# EAGLE schematic dexterity (EAGLE 8.6.0)
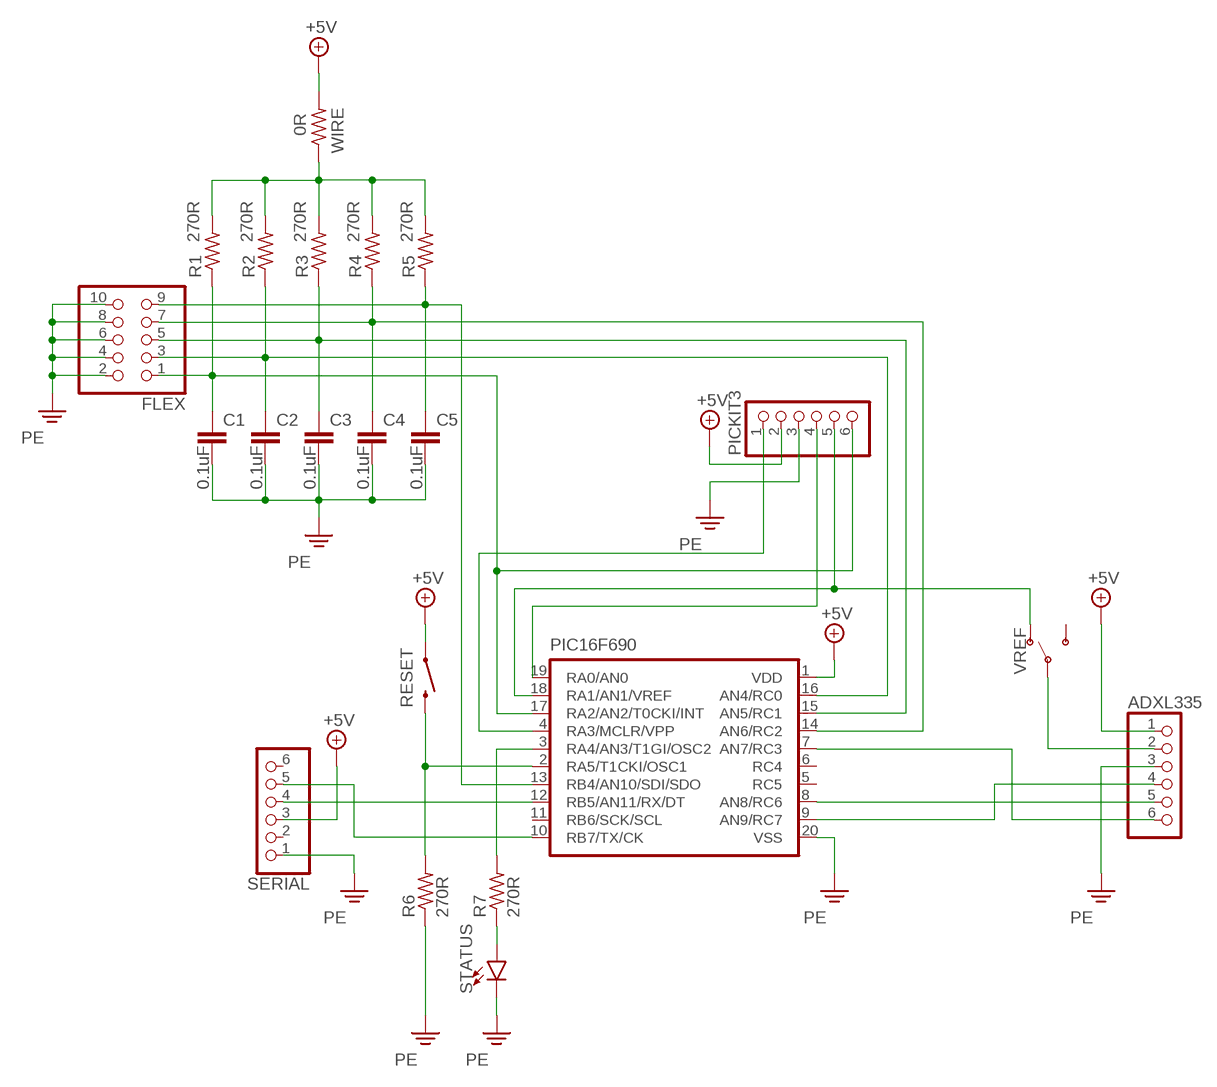
[diagram p0: schematic, sheet 1]

## Parts
ADXL335  PINHD-1X6/90  [1X06/90]
C1  0.1uF  C-EU050-025X075  [C050-025X075]
C2  0.1uF  C-EU050-025X075  [C050-025X075]
C3  0.1uF  C-EU050-025X075  [C050-025X075]
C4  0.1uF  C-EU050-025X075  [C050-025X075]
C5  0.1uF  C-EU050-025X075  [C050-025X075]
FLEX  PINHD-2X5/90  [2X05/90]
PIC16F690  PIC16F6XX  [DIL20]
PICKIT3  PINHD-1X6  [1X06]
R1  270R  R-US_0207/7  [0207/7]
R2  270R  R-US_0207/7  [0207/7]
R3  270R  R-US_0207/7  [0207/7]
R4  270R  R-US_0207/7  [0207/7]
R5  270R  R-US_0207/7  [0207/7]
R6  270R  R-US_0207/7  [0207/7]
R7  270R  R-US_0207/7  [0207/7]
RESET  MOMENTARY-SWITCH-SPST-PTH-6.0MM  [TACTILE_SWITCH_PTH_6.0MM]
SERIAL  PINHD-1X6/90  [1X06/90]
STATUS  LED3MM  [LED_3MM]
VREF  SWITCH-SPDT-PTH-11.6X4.0MM  [SWITCH_SPDT_PTH_11.6X4.0MM]
WIRE  0R  R-US_0207/7  [0207/7]

## Nets
+5V: ADXL335.1 PIC16F690.1(VDD) PICKIT3.2 R1.2 R2.2 R3.2 R4.2 R5.2 RESET.1 SERIAL.3 WIRE.1 WIRE.2
GND: ADXL335.3 C1.2 C2.2 C3.2 C4.2 C5.2 FLEX.2 FLEX.4 FLEX.6 FLEX.8 FLEX.10 PIC16F690.20(VSS) PICKIT3.3 R6.1 SERIAL.1 STATUS.K(C) ; supply symbol labelled PE
N$1: ADXL335.2 VREF.2(P)
N$2: PIC16F690.18(RA1/AN1/VREF) PICKIT3.5 VREF.1(O)
N$3: PIC16F690.12(RB5/AN11/RX/DT) SERIAL.4
N$4: PIC16F690.10(RB7/TX/CK) SERIAL.5
N$5: PIC16F690.3(RA4/AN3/T1GI/OSC2) R7.2
N$6: ADXL335.5 PIC16F690.8(AN8/RC6)
N$7: ADXL335.6 PIC16F690.7(AN7/RC3)
N$8: PIC16F690.4(RA3/MCLR/VPP) PICKIT3.1
N$9: C2.1 FLEX.3 PIC16F690.16(AN4/RC0) R2.1
N$10: PIC16F690.19(RA0/AN0) PICKIT3.4
N$11: C1.1 FLEX.1 PIC16F690.17(RA2/AN2/T0CKI/INT) PICKIT3.6 R1.1
N$12: C3.1 FLEX.5 PIC16F690.15(AN5/RC1) R3.1
N$13: C4.1 FLEX.7 PIC16F690.14(AN6/RC2) R4.1
N$14: C5.1 FLEX.9 PIC16F690.13(RB4/AN10/SDI/SDO) R5.1
N$16: ADXL335.4 PIC16F690.9(AN9/RC7)
N$17: R7.1 STATUS.A
N$18: PIC16F690.2(RA5/T1CKI/OSC1) R6.2 RESET.3
Unconnected: PIC16F690.5(RC5) PIC16F690.6(RC4) PIC16F690.11(RB6/SCK/SCL) SERIAL.2 SERIAL.6 VREF.3(S)

## Library data of the parts
ADXL335 PICKIT3 SERIAL = pinhead:PINHD-1X6: PIN HEADER
C1-C5 = rcl:C-EU: CAPACITOR, European symbol; SPICEPREFIX: C
FLEX = pinhead:PINHD-2X5: PIN HEADER
PIC16F690 = pic16f690:PIC16F6XX
R1-R7 WIRE = rcl:R-US_: RESISTOR, American symbol; SPICEPREFIX: R
RESET = SparkFun-Switches:MOMENTARY-SWITCH-SPST: Momentary Switch (Pushbutton) - SPST Normally-open (NO) SPST momentary switches (buttons, pushbuttons). Variants PTH-12MM - 12mm square, through-hole Momentary Pushbutton Switch - 12mm Square <https://www.sparkfun.com/products/9190> (COM-09190) PTH-6.0MM, PTH-6.0MM-KIT - 6.0mm square, through-hole Mini Pushbutton Switch <https://www.sparkfun.com/products/97> (COM-00097) KIT package intended for soldering kit's - only one side of pads' copper is exposed. PTH-RIGHT-ANGLE-KIT - Right-angle, through-hole Right Angle Tactile Button <https://www.sparkfun.com/products/10791> - Used on SparkFun BigTime Watch Kit <https://www.sparkfun.com/products/11734> SMD-12MM - 12mm square, surface-mount Tactile Button - SMD (12mm) <https://www.sparkfun.com/products/12993> (COM-12993) Used on SparkFun PicoBoard <https://www.sparkfun.com/products/11888> SMD-4.5MM - 4.5mm Square Trackball Switch Used on SparkFun Blackberry Trackballer Breakout <https://www.sparkfun.com/products/13169> SMD-4.6MMX2.8MM - 4.60mm x 2.80mm, surface mount Used on SparkFun SAMD21 Mini Breakout <https://www.sparkfun.com/products/13664> SMD-5.2MM, SMD-5.2-REDUNDANT - 5.2mm square, surface-mount Mini Pushbutton Switch - SMD <https://www.sparkfun.com/products/8720> (COM-08720) Used on Arduino Pro Mini <https://www.sparkfun.com/products/11114> REDUNDANT package connects both switch circuits together SMD-6.0X3.5MM - 6.0 x 3.5mm, surface mount Momentary Reset Switch SMD <https://www.sparkfun.com/products/8229> (COM-08229) SMD-6.2MM-TALL - 6.2mm square, surface mount Tactile Button - SMD (6mm) <https://www.sparkfun.com/products/12992> Used on SparkFun Digital Sandbox <https://www.sparkfun.com/products/12651> SMD-RIGHT-ANGLE - Right-angle, surface mount Used on SparkFun Block for Intel® Edison - Arduino <https://www.sparkfun.com/products/13036>; PROD_ID: SWCH-08441; SF_SKU: COM-00097
STATUS = SparkFun-LED:LED: LED (Generic) Standard schematic elements and footprints for 5mm, 3mm, 1206, and 0603 sized LEDs. Generic LEDs with no color specified.; PROD_ID: DIO-08794
VREF = SparkFun-Switches:SWITCH-SPDT: Single Pole, Double Throw (SPDT) Switch Single-pole, double-throw (SPDT) switch. Variant Overview SMD-AYZ0202 Surface Mount DPDT Switch <https://www.sparkfun.com/products/597> (COM-00597) Used on e.g. LilyPad Arduino USB - ATmega32U4 Board <https://www.sparkfun.com/products/12049> PTH-11.6X4.0MM SPDT Mini Power Switch <https://www.sparkfun.com/products/102> (COM-00102) Used on e.g. SparkFun Simon Says - Through-Hole Soldering Kit <https://www.sparkfun.com/products/10547> (KIT-10547) PTH-11.6X4.0MM-KIT KIT version of SPDT Mini Power Switch - Simplifies soldering by removing tStop of switch pins - only one side can be soldered. PTH-11.6X4.0MM-LOCK LOCK version of SPDT Mini Power Switch - Offset pins hold switch in place for easier soldering. SMD-RIGHT-ANGLE Surface Mount Right Angle Switch <https://www.sparkfun.com/products/10860> (COM-10860) Used on e.g. SparkFun ESP8266 Thing <https://www.sparkfun.com/products/13231>; PROD_ID: SWCH-08261; SF_SKU: COM-00102